# EAGLE design PhotonOnAStick-Wide (EAGLE 7.4.0)
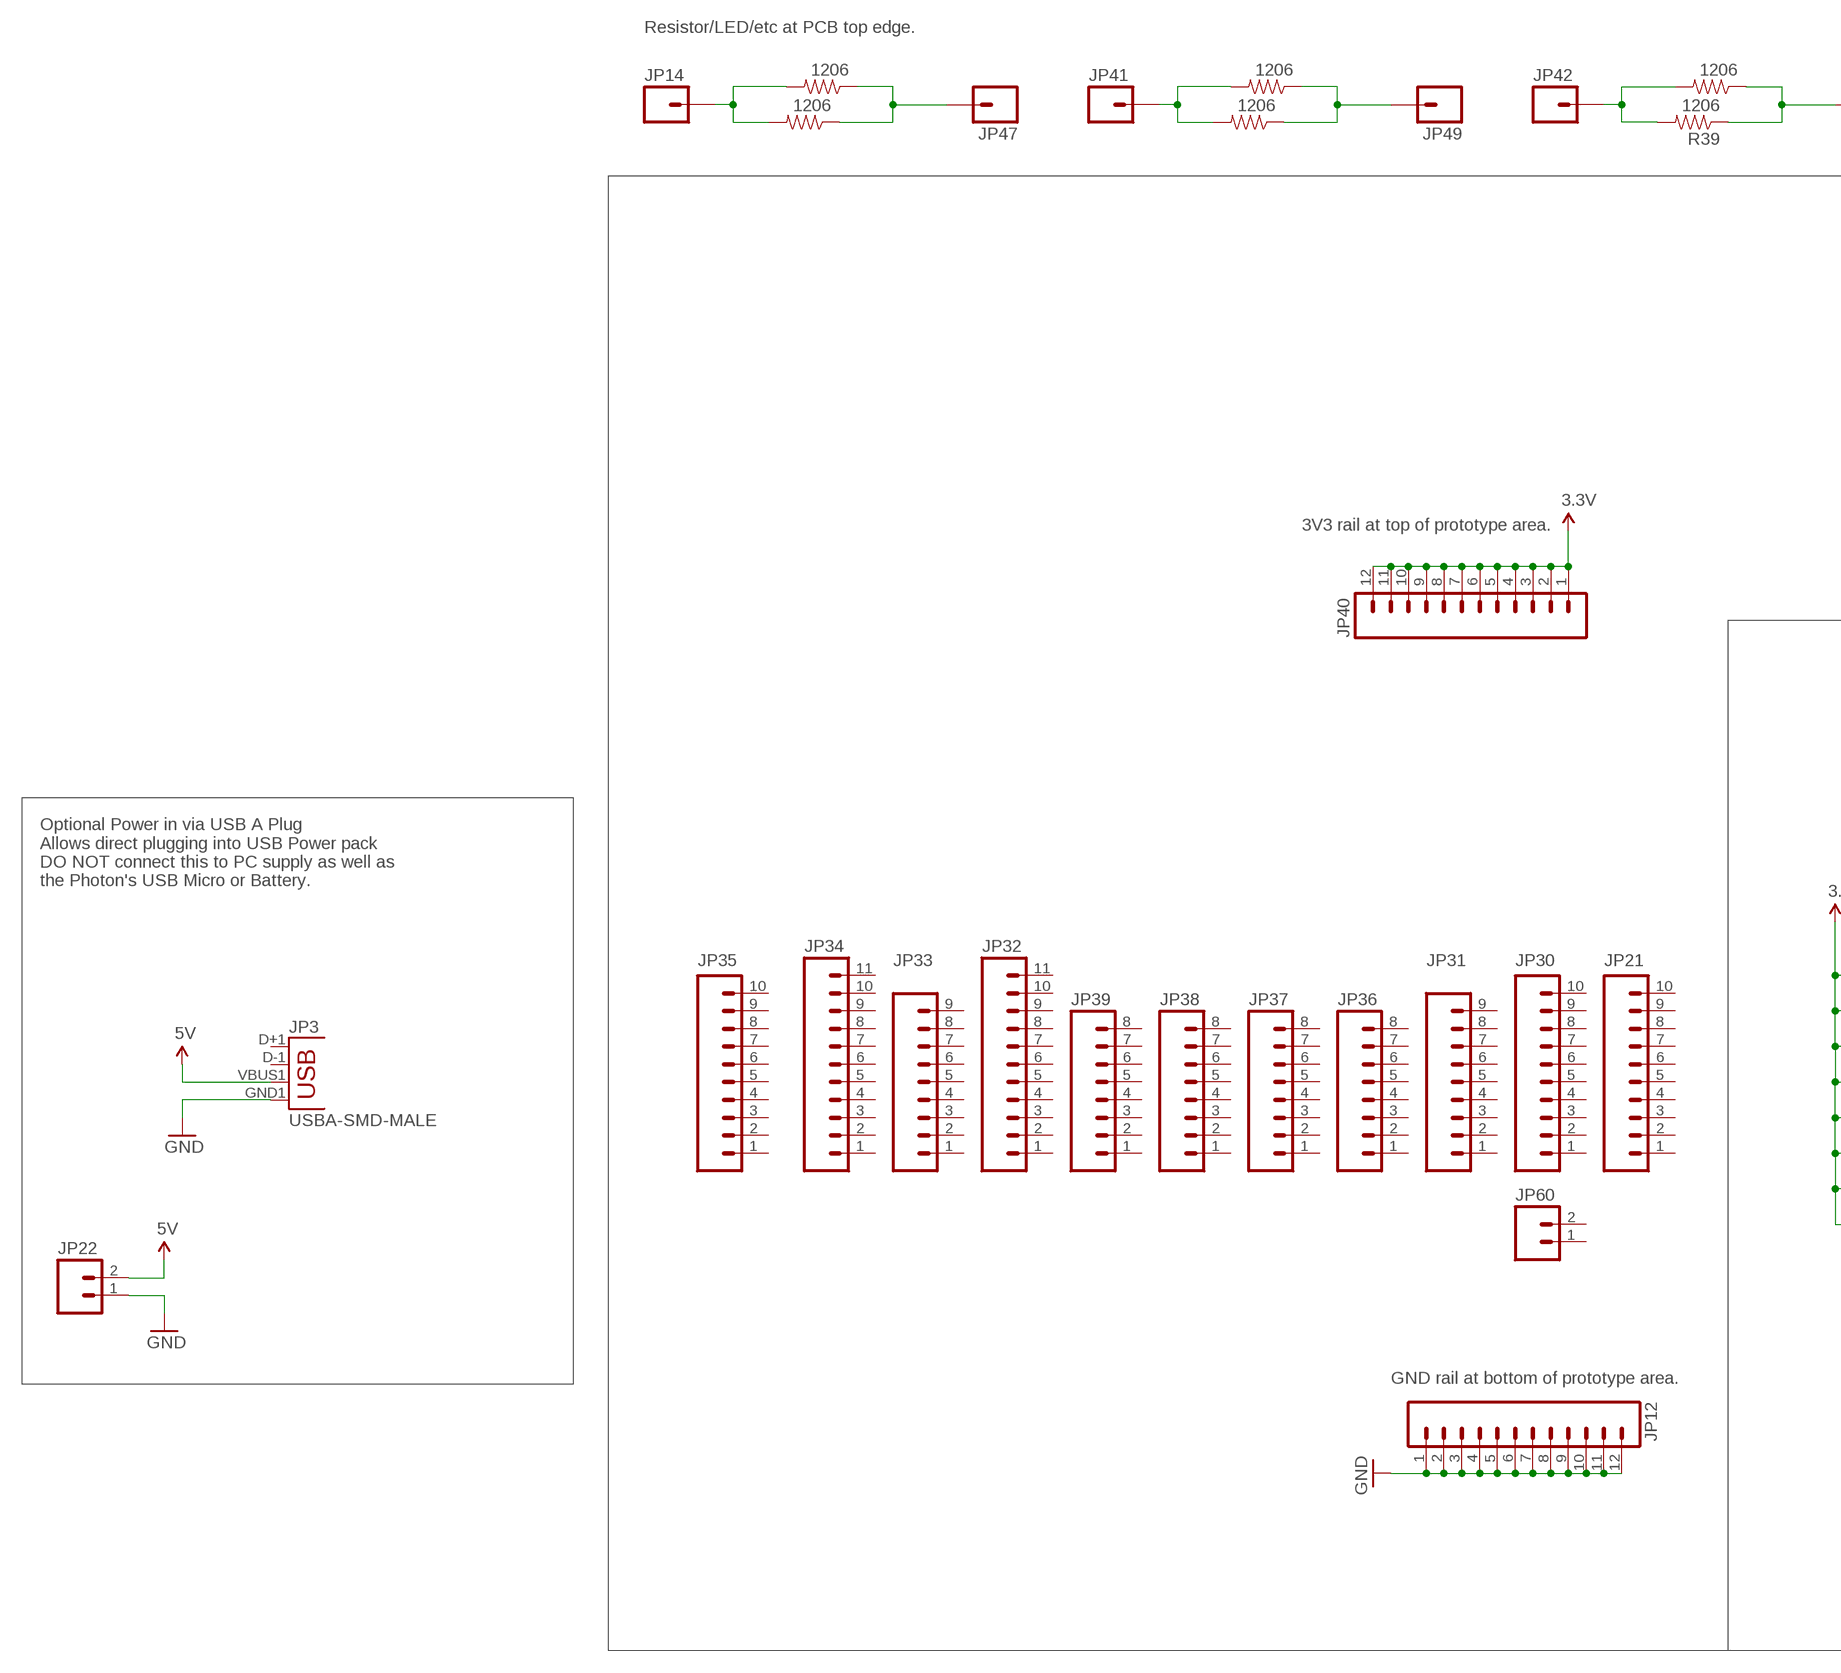
[diagram p0: schematic, sheet 1, part 1 of 2]
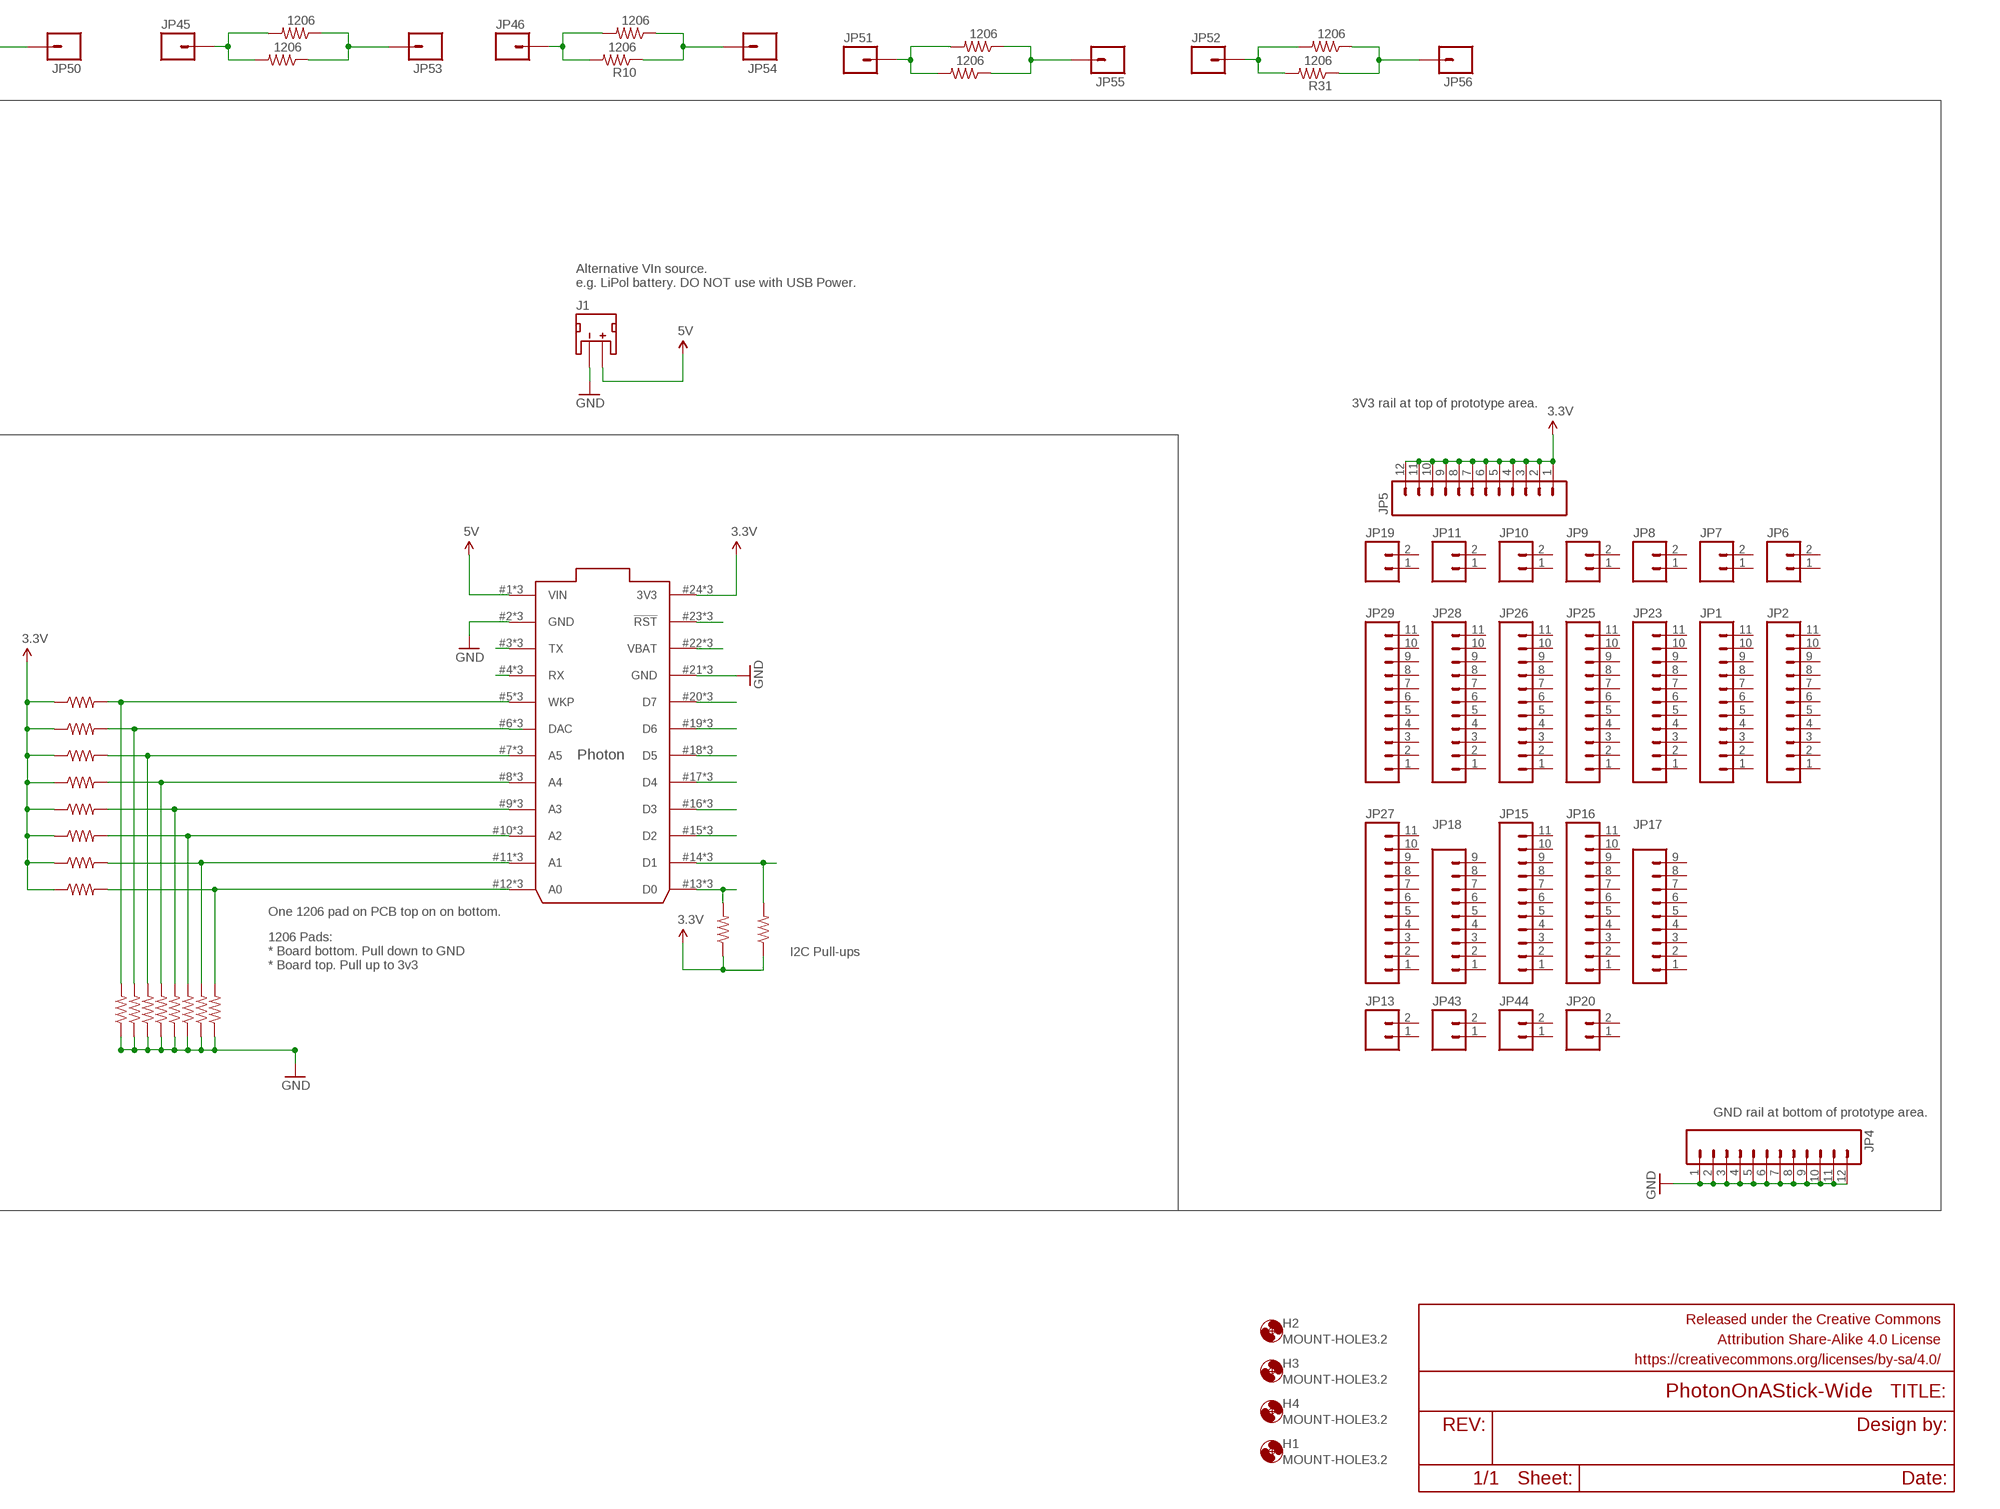
[diagram p1: schematic, sheet 1, part 2 of 2]

## Parts
FRAME1  FRAME-LEDGER  [CREATIVE_COMMONS]
H1  MOUNT-HOLE3.2  [3,2]
H2  MOUNT-HOLE3.2  [3,2]
H3  MOUNT-HOLE3.2  [3,2]
H4  MOUNT-HOLE3.2  [3,2]
IC1  PHOTON_WITH_STACKABLE_HEADERS  [PHOTON_STACKABLE]
J1  JST_2MM_MALE  [JST-2-SMD]
JP1  M111X11_NO_SILK  [1X11_NO_SILK]
JP2  M111X11_NO_SILK  [1X11_NO_SILK]
JP3  USBA-SMD-MALE  [USB-A-SMT-MALE]
JP4  M12PTH  [1X12]
JP5  M12PTH  [1X12]
JP6  M021X02_NO_SILK  [1X02_NO_SILK]
JP7  M021X02_NO_SILK  [1X02_NO_SILK]
JP8  M021X02_NO_SILK  [1X02_NO_SILK]
JP9  M021X02_NO_SILK  [1X02_NO_SILK]
JP10  M021X02_NO_SILK  [1X02_NO_SILK]
JP11  M021X02_NO_SILK  [1X02_NO_SILK]
JP12  M12PTH  [1X12]
JP13  M021X02_NO_SILK  [1X02_NO_SILK]
JP14  M01PTH  [1X01]
JP15  M111X11_NO_SILK  [1X11_NO_SILK]
JP16  M111X11_NO_SILK  [1X11_NO_SILK]
JP17  M09NO_SILK  [1X09_NO_SILK]
JP18  M09NO_SILK  [1X09_NO_SILK]
JP19  M021X02_NO_SILK  [1X02_NO_SILK]
JP20  M021X02_NO_SILK  [1X02_NO_SILK]
JP21  M10NO_SILK_PTH_FEMALE  [1X10_NO_SILK]
JP22  M021X02_NO_SILK  [1X02_NO_SILK]
JP23  M111X11_NO_SILK  [1X11_NO_SILK]
JP25  M111X11_NO_SILK  [1X11_NO_SILK]
JP26  M111X11_NO_SILK  [1X11_NO_SILK]
JP27  M111X11_NO_SILK  [1X11_NO_SILK]
JP28  M111X11_NO_SILK  [1X11_NO_SILK]
JP29  M111X11_NO_SILK  [1X11_NO_SILK]
JP30  M10NO_SILK_PTH_FEMALE  [1X10_NO_SILK]
JP31  M09NO_SILK  [1X09_NO_SILK]
JP32  M111X11_NO_SILK  [1X11_NO_SILK]
JP33  M09NO_SILK  [1X09_NO_SILK]
JP34  M111X11_NO_SILK  [1X11_NO_SILK]
JP35  M10NO_SILK_PTH_FEMALE  [1X10_NO_SILK]
JP36  M08NO_SILK_FEMALE_PTH  [1X08_NO_SILK]
JP37  M08NO_SILK_FEMALE_PTH  [1X08_NO_SILK]
JP38  M08NO_SILK_FEMALE_PTH  [1X08_NO_SILK]
JP39  M08NO_SILK_FEMALE_PTH  [1X08_NO_SILK]
JP40  M12PTH  [1X12]
JP41  M01PTH  [1X01]
JP42  M01PTH  [1X01]
JP43  M021X02_NO_SILK  [1X02_NO_SILK]
JP44  M021X02_NO_SILK  [1X02_NO_SILK]
JP45  M01PTH  [1X01]
JP46  M01PTH  [1X01]
JP47  M01PTH  [1X01]
JP49  M01PTH  [1X01]
JP50  M01PTH  [1X01]
JP51  M01PTH  [1X01]
JP52  M01PTH  [1X01]
JP53  M01PTH  [1X01]
JP54  M01PTH  [1X01]
JP55  M01PTH  [1X01]
JP56  M01PTH  [1X01]
JP60  M021X02_NO_SILK  [1X02_NO_SILK]
R1  1206  RESISTOR1206  [1206]
R2  1206  RESISTOR1206  [1206]
R3  1206  RESISTOR1206  [1206]
R4  1206  RESISTOR1206  [1206]
R5  1206  RESISTOR1206  [1206]
R6  1206  RESISTOR1206  [1206]
R7  1206  RESISTOR1206  [1206]
R8  1206  RESISTOR1206  [1206]
R9  1206  RESISTOR1206  [1206]
R10  1206  RESISTOR1206  [1206]
R12  1206  RESISTOR1206  [1206]
R13  1206  RESISTOR1206  [1206]
R14  1206  RESISTOR1206  [1206]
R15  1206  RESISTOR1206  [1206]
R16  1206  RESISTOR1206  [1206]
R17  1206  RESISTOR1206  [1206]
R19  1206  RESISTOR1206  [1206]
R20  1206  RESISTOR1206  [1206]
R21  1206  RESISTOR1206  [1206]
R22  1206  RESISTOR1206  [1206]
R24  1206  RESISTOR1206  [1206]
R30  1206  RESISTOR1206  [1206]
R31  1206  RESISTOR1206  [1206]
R32  1206  RESISTOR1206  [1206]
R34  1206  RESISTOR1206  [1206]
R35  1206  RESISTOR1206  [1206]
R36  1206  RESISTOR1206  [1206]
R37  1206  RESISTOR1206  [1206]
R39  1206  RESISTOR1206  [1206]
R40  1206  RESISTOR1206  [1206]
R41  1206  RESISTOR1206  [1206]
R44  1206  RESISTOR1206  [1206]

## Nets
3.3V: IC1.24(3V3) IC1.#24(3V3) IC1.@24(3V3) JP5.1 JP5.2 JP5.3 JP5.4 JP5.5 JP5.6 JP5.7 JP5.8 JP5.9 JP5.10 JP5.11 JP5.12 JP40.1 JP40.2 JP40.3 JP40.4 JP40.5 JP40.6 JP40.7 JP40.8 JP40.9 JP40.10 JP40.11 JP40.12 R1.1 R2.1 R3.1 R4.1 R5.1 R6.1 R7.1 R9.1 R12.1 R15.1
5V: IC1.1(VIN) IC1.#1(VIN) IC1.@1(VIN) J1.2(+) JP3.VBUS1(VBUS) JP22.2
GND: IC1.2(GND) IC1.21(GND) IC1.#2(GND) IC1.#21(GND) IC1.@2(GND) IC1.@21(GND) J1.1(-) JP3.GND1(GND) JP4.1 JP4.2 JP4.3 JP4.4 JP4.5 JP4.6 JP4.7 JP4.8 JP4.9 JP4.10 JP4.11 JP4.12 JP12.1 JP12.2 JP12.3 JP12.4 JP12.5 JP12.6 JP12.7 JP12.8 JP12.9 JP12.10 JP12.11 JP12.12 JP22.1 R8.1 R13.1 R14.1 R16.1 R19.1 R20.1 R21.1 R22.1
N$1: JP42.1 R39.2 R44.2
N$2: IC1.22(VBAT) IC1.#22(VBAT) IC1.@22(VBAT)
N$3: IC1.20(D7) IC1.#20(D7) IC1.@20(D7)
N$4: JP53.1 R17.1 R24.1
N$5: JP45.1 R17.2 R24.2
N$6: IC1.5(WKP) IC1.#5(WKP) IC1.@5(WKP) R8.2 R12.2
N$7: IC1.6(DAC) IC1.#6(DAC) IC1.@6(DAC) R15.2 R16.2
N$8: IC1.7(A5) IC1.#7(A5) IC1.@7(A5) R1.2 R13.2
N$9: IC1.8(A4) IC1.#8(A4) IC1.@8(A4) R2.2 R14.2
N$10: IC1.9(A3) IC1.#9(A3) IC1.@9(A3) R3.2 R19.2
N$11: IC1.10(A2) IC1.#10(A2) IC1.@10(A2) R4.2 R20.2
N$12: IC1.11(A1) IC1.#11(A1) IC1.@11(A1) R6.2 R21.2
N$13: IC1.12(A0) IC1.#12(A0) IC1.@12(A0) R7.2 R22.2
N$14: IC1.19(D6) IC1.#19(D6) IC1.@19(D6)
N$15: IC1.13(D0) IC1.#13(D0) IC1.@13(D0) R5.2
N$16: IC1.14(D1) IC1.#14(D1) IC1.@14(D1) R9.2
N$17: IC1.18(D5) IC1.#18(D5) IC1.@18(D5)
N$18: IC1.17(D4) IC1.#17(D4) IC1.@17(D4)
N$19: IC1.16(D3) IC1.#16(D3) IC1.@16(D3)
N$20: IC1.15(D2) IC1.#15(D2) IC1.@15(D2)
N$21: JP46.1 R10.2 R30.2
N$22: JP54.1 R10.1 R30.1
N$23: JP55.1 R32.1 R36.1
N$24: JP51.1 R32.2 R36.2
N$25: JP56.1 R31.1 R37.1
N$26: JP52.1 R31.2 R37.2
N$27: IC1.4(RX) IC1.#4(RX) IC1.@4(RX)
N$28: IC1.3(TX) IC1.#3(TX) IC1.@3(TX)
N$30: IC1.23(!RST) IC1.#23(!RST) IC1.@23(!RST)
N$43: JP47.1 R34.1 R35.1
N$52: JP14.1 R34.2 R35.2
N$64: JP49.1 R40.1 R41.1
N$65: JP41.1 R40.2 R41.2
N$72: JP50.1 R39.1 R44.1
Unconnected: J1.NC1(PAD1) J1.NC2(PAD2) JP1.1 JP1.2 JP1.3 JP1.4 JP1.5 JP1.6 JP1.7 JP1.8 JP1.9 JP1.10 JP1.11 JP2.1 JP2.2 JP2.3 JP2.4 JP2.5 JP2.6 JP2.7 JP2.8 JP2.9 JP2.10 JP2.11 JP3.D+1(D+) JP3.D-1(D-) JP6.1 JP6.2 JP7.1 JP7.2 JP8.1 JP8.2 JP9.1 JP9.2 JP10.1 JP10.2 JP11.1 JP11.2 JP13.1 JP13.2 JP15.1 JP15.2 JP15.3 JP15.4 JP15.5 JP15.6 JP15.7 JP15.8 JP15.9 JP15.10 JP15.11 JP16.1 JP16.2 JP16.3 JP16.4 JP16.5 JP16.6 JP16.7 JP16.8 JP16.9 JP16.10 JP16.11 JP17.1 JP17.2 JP17.3 JP17.4 JP17.5 JP17.6 JP17.7 JP17.8 JP17.9 JP18.1 JP18.2 JP18.3 JP18.4 JP18.5 JP18.6 JP18.7 JP18.8 JP18.9 JP19.1 JP19.2 JP20.1 JP20.2 JP21.1 JP21.2 JP21.3 JP21.4 JP21.5 JP21.6 JP21.7 JP21.8 JP21.9 JP21.10 JP23.1 JP23.2 JP23.3 JP23.4 JP23.5 JP23.6 JP23.7 JP23.8 JP23.9 JP23.10 JP23.11 JP25.1 JP25.2 JP25.3 JP25.4 JP25.5 JP25.6 JP25.7 JP25.8 JP25.9 JP25.10 JP25.11 JP26.1 JP26.2 JP26.3 JP26.4 JP26.5 JP26.6 JP26.7 JP26.8 JP26.9 JP26.10 JP26.11 JP27.1 JP27.2 JP27.3 JP27.4 JP27.5 JP27.6 JP27.7 JP27.8 JP27.9 JP27.10 JP27.11 JP28.1 JP28.2 JP28.3 JP28.4 JP28.5 JP28.6 JP28.7 JP28.8 JP28.9 JP28.10 JP28.11 JP29.1 JP29.2 JP29.3 JP29.4 JP29.5 JP29.6 JP29.7 JP29.8 JP29.9 JP29.10 JP29.11 JP30.1 JP30.2 JP30.3 JP30.4 JP30.5 JP30.6 JP30.7 JP30.8 JP30.9 JP30.10 JP31.1 JP31.2 JP31.3 JP31.4 JP31.5 JP31.6 JP31.7 JP31.8 JP31.9 JP32.1 JP32.2 JP32.3 JP32.4 JP32.5 JP32.6 JP32.7 JP32.8 JP32.9 JP32.10 JP32.11 JP33.1 JP33.2 JP33.3 JP33.4 JP33.5 JP33.6 JP33.7 JP33.8 JP33.9 JP34.1 JP34.2 JP34.3 JP34.4 JP34.5 JP34.6 JP34.7 JP34.8 JP34.9 JP34.10 JP34.11 JP35.1 JP35.2 JP35.3 JP35.4 JP35.5 JP35.6 JP35.7 JP35.8 JP35.9 JP35.10 JP36.1 JP36.2 JP36.3 JP36.4 JP36.5 JP36.6 JP36.7 JP36.8 JP37.1 JP37.2 JP37.3 JP37.4 JP37.5 JP37.6 JP37.7 JP37.8 JP38.1 JP38.2 JP38.3 JP38.4 JP38.5 JP38.6 JP38.7 JP38.8 JP39.1 JP39.2 JP39.3 JP39.4 JP39.5 JP39.6 JP39.7 JP39.8 JP43.1 JP43.2 JP44.1 JP44.2 JP60.1 JP60.2

## Notes on the sheet
- Resistor/LED/etc at PCB top edge.
- Alternative VIn source.
  e.g. LiPol battery. DO NOT use with USB Power.
- 3V3 rail at top of prototype area.
- 3V3 rail at top of prototype area.
- Optional Power in via USB A Plug
  Allows direct plugging into USB Power pack
  DO NOT connect this to PC supply as well as
  the Photon's USB Micro or Battery.
- One 1206 pad on PCB top on on bottom.
- I2C Pull-ups
- 1206 Pads:
  * Board bottom. Pull down to GND
  * Board top. Pull up to 3v3
- GND rail at bottom of prototype area.
- GND rail at bottom of prototype area.

## Library data of the parts
FRAME1 = SparkFun-Aesthetics:FRAME-LEDGER: Schematic Frame Standard 11x14 US Ledger frame
H1-H4 = holes:MOUNT-HOLE: MOUNTING HOLE with drill center marker
IC1 = Particle:PHOTON
J1 = SparkFun-Connectors:JST_2MM_MALE: Mates to single-cell LiPo batteries. CONN-11443 Now with smashable polarity marks!; BTM_NEG: -; BTM_POS: +; PROD_ID: CONN-11443; TOP_NEG: -; TOP_POS: +
JP1 JP2 JP15 JP16 JP23 JP25-JP29 JP32 JP34 = SparkFun-Connectors:M11: Header 11 Standard 11-pin 0.1" header. Use with straight break away headers (SKU : PRT-00116), right angle break away headers (PRT-00553), swiss pins (PRT-00743), machine pins (PRT-00117), and female headers (PRT-00115).
JP3 = SparkFun-Connectors:USB: USB Connectors USB-B-PTH is fully proven SKU : PRT-00139/CONN-08278 USB-miniB is fully proven SKU : PRT-00587 USB-A-PCB is untested. USB-A-H is throughly reviewed, but untested. Spark Fun Electronics SKU : PRT-00437 USB-B-SMT is throughly reviewed, but untested. Needs silkscreen touching up. USB-A-S has not been used/tested USB-MB-H has not been used/tested USB-MICROB has been used. CONN-09505
JP4 JP5 JP12 JP40 = SparkFun-Connectors:M12: Header 12 Standard 12-pin 0.1" header. Use with straight break away headers (SKU : PRT-00116), right angle break away headers (PRT-00553), swiss pins (PRT-00743), machine pins (PRT-00117), and female headers (PRT-00115).
JP6-JP11 JP13 JP19 JP20 JP22 JP43 JP44 JP60 = SparkFun-Connectors:M02: Standard 2-pin 0.1" header. Use with - straight break away headers ( PRT-00116) - right angle break away headers (PRT-00553) - swiss pins (PRT-00743) - machine pins (PRT-00117) - female headers (PRT-00115) Molex polarized connector foot print use with: PRT-08233 with associated crimp pins and housings. 2.54_SCREWTERM for use with PRT-10571. 3.5mm Screw Terminal footprints for PRT-08084 5mm Screw Terminal footprints for use with PRT-08432
JP14 JP41 JP42 JP45-JP47 JP49-JP56 = SparkFun-Connectors:M01: Header 1 Standard 1-pin 0.1" header. Use with straight break away headers (SKU : PRT-00116), right angle break away headers (PRT-00553), swiss pins (PRT-00743), machine pins (PRT-00117), and female headers (PRT-00115).
JP17 JP18 JP31 JP33 = SparkFun-Connectors:M09: Header 9 Standard 9-pin 0.1" header. Use with straight break away headers (SKU : PRT-00116), right angle break away headers (PRT-00553), swiss pins (PRT-00743), machine pins (PRT-00117), and female headers (PRT-00115).
JP21 JP30 JP35 = SparkFun-Connectors:M10: Header 10 Standard 10-pin 0.1" header. Use with straight break away headers (SKU : PRT-00116), right angle break away headers (PRT-00553), swiss pins (PRT-00743), machine pins (PRT-00117), and female headers (PRT-00115).; PROD_ID: CONN-11563
JP36-JP39 = SparkFun-Connectors:M08: Header 8 Standard 8-pin 0.1" header. Use with straight break away headers (SKU : PRT-00116), right angle break away headers (PRT-00553), swiss pins (PRT-00743), machine pins (PRT-00117), and female headers (PRT-00115).; PROD_ID: CONN-08438
R1-R10 R12-R17 R19-R22 R24 R30-R32 R34-R37 R39-R41 R44 = SparkFun-Resistors:RESISTOR: Resistor Basic schematic elements and footprints for 0603, 1206, and PTH resistors.

## Board
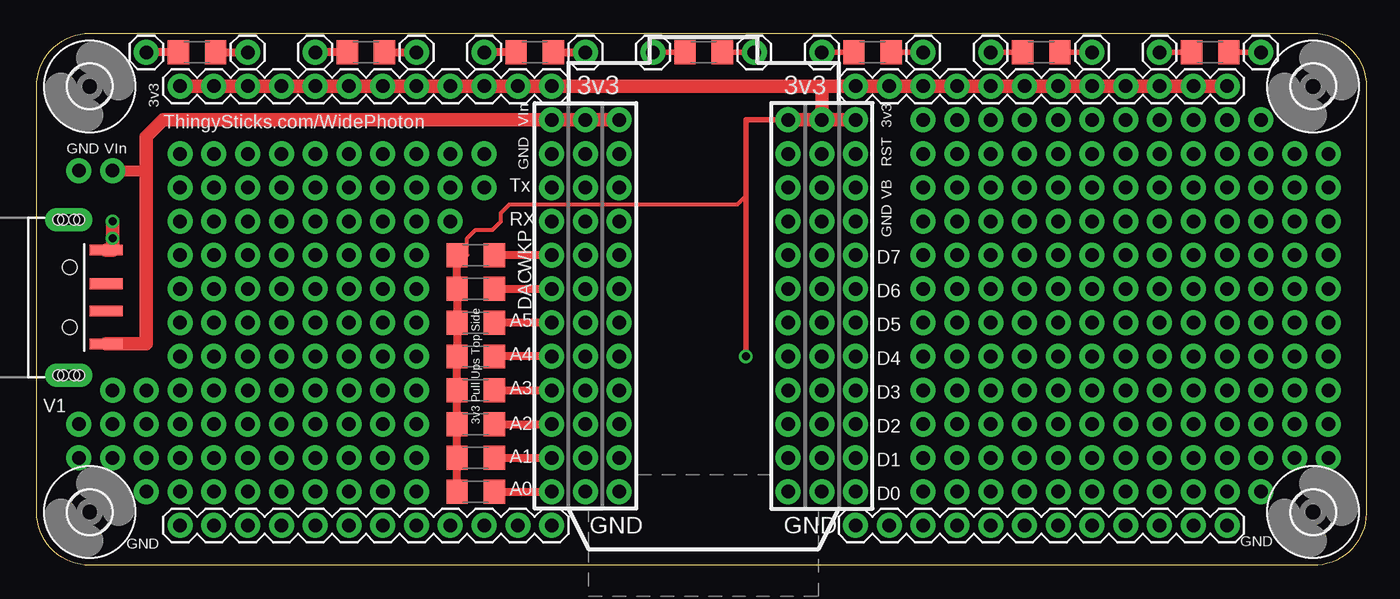
[diagram p2: board, top side]
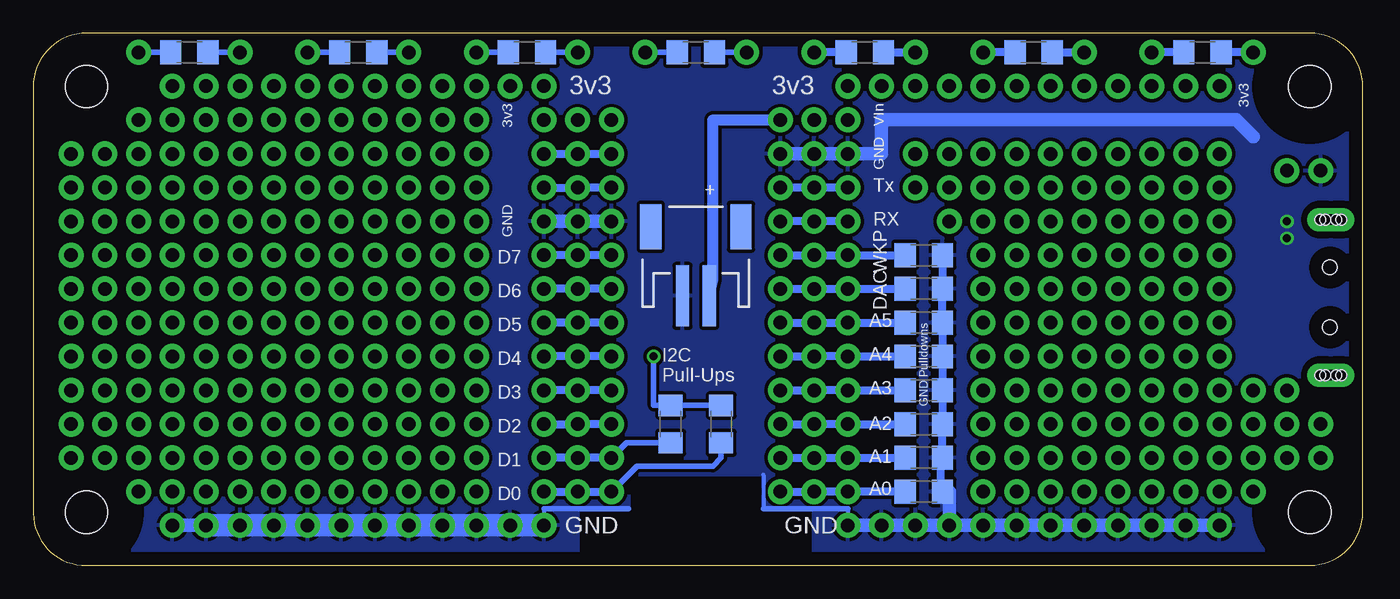
[diagram p3: board, bottom side, seen from below]

Size 100 x 40 mm. Coordinates in mm from the lower left corner, seen from the top.
Outline: 96,40 arc-90 100,36 100,3.9 arc-90 96,0 4,0 arc-90 0,4 0,36 arc-90 4,40 96,40
Copper layers (1*16): Top 0.035mm / dielectric 1.5mm / Bottom 0.035mm
Design rules "default": minimum track width 10mil, minimum drill 24mil, track to track 8mil, track to pad 8mil, pad to pad 8mil, via to via 8mil, smd to smd 8mil, copper to edge 40mil, drill to drill 8mil, minimum pad ring 10mil, minimum via ring 8mil, stop-mask expansion 4mil, vias tented up to drill 0mil, thermal gap 10mil

### Footprints (pad centres in the part's own frame; a part is rotated, then mirrored left to right if it is on the bottom)
3,2 = hole 3.2: 0,0
PHOTON_STACKABLE = drill 1.016 pad 1.88: 1 1.27,32.258; 2 1.27,29.718; 3 1.27,27.178; 4 1.27,24.638; 5 1.27,22.098; 6 1.27,19.558; 7 1.27,17.018; 8 1.27,14.478; 9 1.27,11.938; 10 1.27,9.398; 11 1.27,6.858; 12 1.27,4.318; 13 19.05,4.318; 14 19.05,6.858; 15 19.05,9.398; 16 19.05,11.938; 17 19.05,14.478; 18 19.05,17.018; 19 19.05,19.558; 20 19.05,22.098; 21 19.05,24.638; 22 19.05,27.178; 23 19.05,29.718; 24 19.05,32.258; #1 3.81,32.258; #2 3.81,29.718; #3 3.81,27.178; #4 3.81,24.638; #5 3.81,22.098; #6 3.81,19.558; #7 3.81,17.018; #8 3.81,14.478; #9 3.81,11.938; #10 3.81,9.398; #11 3.81,6.858; #12 3.81,4.318; #13 21.59,4.318; #14 21.59,6.858; #15 21.59,9.398; #16 21.59,11.938; #17 21.59,14.478; #18 21.59,17.018; #19 21.59,19.558; #20 21.59,22.098; #21 21.59,24.638; #22 21.59,27.178; #23 21.59,29.718; #24 21.59,32.258; @1 -1.27,32.258; @2 -1.27,29.718; @3 -1.27,27.178; @4 -1.27,24.638; @5 -1.27,22.098; @6 -1.27,19.558; @7 -1.27,17.018; @8 -1.27,14.478; @9 -1.27,11.938; @10 -1.27,9.398; @11 -1.27,6.858; @12 -1.27,4.318; @13 16.51,4.318; @14 16.51,6.858; @15 16.51,9.398; @16 16.51,11.938; @17 16.51,14.478; @18 16.51,17.018; @19 16.51,19.558; @20 16.51,22.098; @21 16.51,24.638; @22 16.51,27.178; @23 16.51,29.718; @24 16.51,32.258
JST-2-SMD = smd 1 x 4.6: 1 -1,-3.7; 2 1,-3.7 | smd 1.6 x 3.4: NC1 -3.4,1.5; NC2 3.4,1.5
1X11_NO_SILK = drill 1.016 pad 1.88: 1 0,0; 2 2.54,0; 3 5.08,0; 4 7.62,0; 5 10.16,0; 6 12.7,0; 7 15.24,0; 8 17.78,0; 9 20.32,0; 10 22.86,0; 11 25.4,0
USB-A-SMT-MALE = smd 0.8 x 2.5: D+1 1.027,-5.87; D-1 -1.027,-5.87; GND1 3.551,-5.87; VBUS1 -3.5,-5.87 | drill 0.8 pad 1.778 long: P$1 5.85,-3.05; P$3 -5.85,-3.05 | hole 1.1: 2.25,-3.12; -2.25,-3.12 | hole 0.8: -5.85,-3.45; -5.85,-3.85; -5.85,-2.65; -5.85,-2.25; 5.85,-3.45; 5.85,-3.85; 5.85,-2.65; 5.85,-2.25
1X12 = drill 1.016 pad 1.88: 1 0,0; 2 2.54,0; 3 5.08,0; 4 7.62,0; 5 10.16,0; 6 12.7,0; 7 15.24,0; 8 17.78,0; 9 20.32,0; 10 22.86,0; 11 25.4,0; 12 27.94,0
1X02_NO_SILK = drill 1.016 pad 1.88: 1 0,0; 2 2.54,0
1X01 = drill 1.016 pad 1.88: 1 0,0
1X09_NO_SILK = drill 1.016 pad 1.88: 1 0,0; 2 2.54,0; 3 5.08,0; 4 7.62,0; 5 10.16,0; 6 12.7,0; 7 15.24,0; 8 17.78,0; 9 20.32,0
1X10_NO_SILK = drill 1.016 pad 1.88: 1 0,0; 2 2.54,0; 3 5.08,0; 4 7.62,0; 5 10.16,0; 6 12.7,0; 7 15.24,0; 8 17.78,0; 9 20.32,0; 10 22.86,0
1X08_NO_SILK = drill 1.016 pad 1.88: 1 0,0; 2 2.54,0; 3 5.08,0; 4 7.62,0; 5 10.16,0; 6 12.7,0; 7 15.24,0; 8 17.78,0
1206 = smd 1.6 x 1.8: 1 -1.4,0; 2 1.4,0

### Placement (x,y rotation side)
FRAME1  20.95,-9.7 0 top  (outside the outline)
H1  4,4 0 top
H2  4,36 0 top
H3  96,36 0 top
H4  96,4 0 top
IC1  40.01,1.22 0 top
J1  50.16,23.95 0 bottom
JP1  71.75,15.7 0 top
JP2  71.75,13.16 0 top
JP3  -0.64,20.14 90 top
JP4  61.59,3 0 top
JP5  61.59,36.02 0 top
JP6  66.67,23.32 0 top
JP7  66.67,20.78 0 top
JP8  66.67,18.24 0 top
JP9  66.67,15.7 0 top
JP10  66.67,13.16 0 top
JP11  66.67,10.62 0 top
JP12  38.73,3 180 top
JP13  66.67,30.94 0 top
JP14  33.66,38.56 90 top
JP15  71.75,10.62 0 top
JP16  71.75,8.08 0 top
JP17  71.75,5.54 0 top
JP18  71.75,33.48 0 top
JP19  66.67,8.08 0 top
JP20  66.67,5.54 0 top
JP21  33.66,30.94 180 top
JP22  3.17,29.67 0 top
JP23  71.75,18.24 0 top
JP25  71.75,20.78 0 top
JP26  71.75,23.32 0 top
JP27  71.75,25.86 0 top
JP28  71.75,28.4 0 top
JP29  71.75,30.94 0 top
JP30  33.66,28.4 180 top
JP31  31.11,25.86 180 top
JP32  28.57,10.62 180 top
JP33  28.57,5.54 180 top
JP34  28.57,8.08 180 top
JP35  28.57,13.16 180 top
JP36  28.57,23.32 180 top
JP37  28.57,20.78 180 top
JP38  28.57,18.24 180 top
JP39  28.57,15.7 180 top
JP40  38.73,36.02 180 top
JP41  20.95,38.56 90 top
JP42  8.26,38.56 0 top
JP43  66.67,33.48 0 top
JP44  66.67,28.4 0 top
JP45  46.35,38.56 0 top
JP46  79.38,38.56 0 top
JP47  41.27,38.56 90 top
JP49  28.57,38.56 90 top
JP50  15.88,38.56 0 top
JP51  92.08,38.56 0 top
JP52  66.67,38.56 0 top
JP53  53.98,38.56 0 top
JP54  71.75,38.56 0 top
JP55  84.45,38.56 0 top
JP56  59.05,38.56 0 top
JP60  66.67,25.86 0 top
R1  33.02,18.24 0 top
R2  33.02,15.7 0 top
R3  33.02,13.16 0 top
R4  33.02,10.62 0 top
R5  48.26,10.62 270 bottom
R6  33.02,8.08 0 top
R7  33.02,5.54 0 top
R8  33.02,23.32 180 bottom
R9  52.07,10.62 270 bottom
R10  75.56,38.56 0 top
R12  33.02,23.32 0 top
R13  33.02,18.24 180 bottom
R14  33.02,15.7 180 bottom
R15  33.02,20.78 0 top
R16  33.02,20.78 180 bottom
R17  50.16,38.56 180 top
R19  33.02,13.16 180 bottom
R20  33.02,10.62 180 bottom
R21  33.02,8.08 180 bottom
R22  33.02,5.54 180 bottom
R24  50.16,38.56 0 bottom
R30  75.56,38.56 180 bottom
R31  62.87,38.56 180 bottom
R32  88.27,38.56 180 bottom
R34  37.47,38.56 180 top
R35  37.47,38.56 0 bottom
R36  88.27,38.56 0 top
R37  62.87,38.56 0 top
R39  12.06,38.56 180 top
R40  24.77,38.56 180 top
R41  24.77,38.56 0 bottom
R44  12.06,38.56 0 bottom

### Tracks (layer width: path | path; a pad name or v marks a point on that pad's centre or on a via)
3.3V  (via drill 0.6)
  Top 0.305: 31.75,23.32 32.38,23.32 32.38,24.59 33.02,25.23 34.29,25.23 34.92,25.86 34.92,26.5 35.56,27.13 52.7,27.13 53.34,27.77 53.34,33.48
  Top 0.406: v53.34,15.7 53.34,33.48 IC1.@24
  Top 0.61: R7.1 R6.1 R4.1 R3.1 R2.1 R1.1 R15.1 R12.1
  Top 1.016: R12.1 31.75,23.32 | IC1.24 IC1.@24 | IC1.24 IC1.#24 | JP40.12 JP40.11 JP40.10 JP40.9 JP40.8 JP40.7 JP40.6 JP40.5 JP40.4 JP40.3 JP40.2 | JP40.2 JP40.1 | JP5.12 JP5.11 JP5.10 JP5.9 JP5.8 JP5.7 JP5.6 JP5.5 JP5.4 JP5.3 JP5.2 | JP5.2 JP5.1 | JP5.2 59.05,36.02 | 59.05,36.02 IC1.24 | JP40.2 59.05,36.02
  Bottom 0.406: R5.1 R9.1 53.34,12.02 v53.34,15.7
5V
  Top 0.61: 43.81,33.11 IC1.#1
  Top 0.813: JP22.2 8.26,29.67
  Top 1.016: IC1.#1 IC1.1 IC1.@1 9.53,33.48 8.26,32.21 8.26,29.67 8.26,16.64 JP3.VBUS1
  Bottom 0.813: J1.2 48.9,21.52 48.9,33.48 IC1.#1
GND  (via drill 0.6)
  Top 1.016: JP3.GND1 5.71,23.7 v5.71,24.59 v5.71,25.86
  Bottom 0.305: 61.59,4.27 JP4.1 | 45.09,6.81 45.09,4.27 | 38.73,4.27 JP12.1
  Bottom 0.406: 55.24,4.27 61.59,4.27 | 45.09,4.27 38.73,4.27
  Bottom 0.61: R8.1 R16.1 R13.1 R14.1 R19.1 R20.1 R21.1 31.62,7.45 31.75,7.45 31.75,5.54 R22.1
  Bottom 1.016: IC1.#21 IC1.21 IC1.@21 | JP12.1 JP12.2 JP12.3 JP12.4 | JP12.4 JP12.5 JP12.6 JP12.7 JP12.8 JP12.9 JP12.10 JP12.11 JP12.12 | JP4.11 JP4.12 | JP12.4 31.11,5.54 R22.1 | IC1.#2 IC1.2 IC1.@2 36.2,30.94 36.2,33.48 9.53,33.48 8.26,32.21
  Bottom 1.676: JP4.1 JP4.2 JP4.3 JP4.4 JP4.5 JP4.6 JP4.7 JP4.8 JP4.9 JP4.10 JP4.11
  pour Bottom (isolate 0.254): -0.64,-0.17 41.27,-0.17 41.27,4.27 45.09,4.27 45.09,6.81 55.24,6.81 55.24,4.27 59.05,4.27 59.05,-0.17 100.33,-0.17 100.33,40.47 -0.64,40.47
N$1
  Top 0.61: R44.2 JP42.1
  Bottom 0.61: JP42.1 R44.2
N$2
  Bottom 0.61: IC1.@22 IC1.22 IC1.#22
N$3
  Bottom 0.61: IC1.#20 IC1.20 IC1.@20
N$4
  Top 0.406: R24.1 JP53.1
  Bottom 0.406: R24.1 JP53.1
N$5
  Top 0.406: R17.2 JP45.1
  Bottom 0.406: R17.2 JP45.1
N$6
  Top 0.61: IC1.@5 R8.2
  Bottom 0.61: R8.2 IC1.@5 IC1.5 IC1.#5
N$7
  Top 0.61: R16.2 IC1.@6
  Bottom 0.61: R16.2 IC1.@6 IC1.6 IC1.#6
N$8
  Top 0.61: IC1.@7 R13.2
  Bottom 0.61: R13.2 IC1.@7 IC1.7 IC1.#7
N$9
  Top 0.61: IC1.@8 R14.2
  Bottom 0.61: R14.2 IC1.@8 IC1.8 IC1.#8
N$10
  Top 0.61: R19.2 IC1.@9
  Bottom 0.61: R19.2 IC1.@9 IC1.9 IC1.#9
N$11
  Top 0.61: R20.2 IC1.@10
  Bottom 0.61: R20.2 IC1.@10 IC1.10 IC1.#10
N$12
  Top 0.61: R21.2 IC1.@11
  Bottom 0.61: IC1.#11 IC1.11 IC1.@11 R21.2
N$13
  Top 0.61: R22.2 IC1.@12
  Bottom 0.61: 34.29,5.54 R22.2 IC1.@12 IC1.12 IC1.#12
N$14
  Bottom 0.61: IC1.#19 IC1.19 IC1.@19
N$15
  Bottom 0.406: R5.2 48.26,8.08 48.9,7.45 54.61,7.45 IC1.@13
  Bottom 0.61: IC1.#13 IC1.13 IC1.@13
N$16
  Bottom 0.406: R9.2 55.38,9.22 IC1.@14
  Bottom 0.61: IC1.#14 IC1.14 IC1.@14
N$17
  Bottom 0.61: IC1.#18 IC1.18 IC1.@18
N$18
  Bottom 0.61: IC1.#17 IC1.17 IC1.@17
N$19
  Bottom 0.61: IC1.#16 IC1.16 IC1.@16
N$20
  Bottom 0.61: IC1.#15 IC1.15 IC1.@15
N$21
  Top 0.406: JP46.1 R10.2
  Bottom 0.406: R10.2 JP46.1
N$22
  Top 0.406: JP54.1 R30.1
  Bottom 0.406: R30.1 JP54.1
N$23
  Top 0.406: JP55.1 R36.1
  Bottom 0.406: R36.1 JP55.1
N$24
  Top 0.406: JP51.1 R32.2
  Bottom 0.406: R32.2 JP51.1
N$25
  Top 0.406: JP56.1 R37.1
  Bottom 0.406: R37.1 JP56.1
N$26
  Top 0.406: JP52.1 R37.2
  Bottom 0.406: R37.2 JP52.1
N$27
  Bottom 0.61: IC1.@4 IC1.4 IC1.#4
N$28
  Bottom 0.61: IC1.@3 IC1.3 IC1.#3
N$30
  Bottom 0.61: IC1.#23 IC1.23 IC1.@23
N$43
  Top 0.61: R35.1 JP47.1
  Bottom 0.61: R35.1 JP47.1
N$52
  Top 0.61: R34.2 JP14.1
  Bottom 0.61: R34.2 JP14.1
N$64
  Top 0.61: R41.1 JP49.1
  Bottom 0.61: R41.1 JP49.1
N$65
  Top 0.61: R40.2 JP41.1
  Bottom 0.61: R40.2 JP41.1
N$72
  Top 0.61: R44.1 JP50.1
  Bottom 0.61: R44.1 JP50.1

### Text on the board
tNames: VIn | 3v3 | 3v3 | 3v3 | 3v3 | ThingySticks.com/WidePhoton | GND | RST | GND | VIn | VB | Tx | GND | RX | WKP | D7 | DAC | D6 | A5 | D5 | A4 | D4 | V1 | A3 | D3 | 3v3 Pull Ups Top Side | A2 | D2 | A1 | D1 | A0 | D0 | GND | GND | GND | GND
bNames: VIn | 3v3 | 3v3 | 3v3 | 3v3 | GND | Tx | + | GND | RX | WKP | D7 | DAC | D6 | GND Pulldowns | A5 | D5 | A4 | D4 | I2C / Pull-Ups | A3 | D3 | A2 | D2 | A1 | D1 | A0 | D0 | GND | GND
Document: Stephen Harrison